# EAGLE design vyndej (EAGLE 9.5.2)
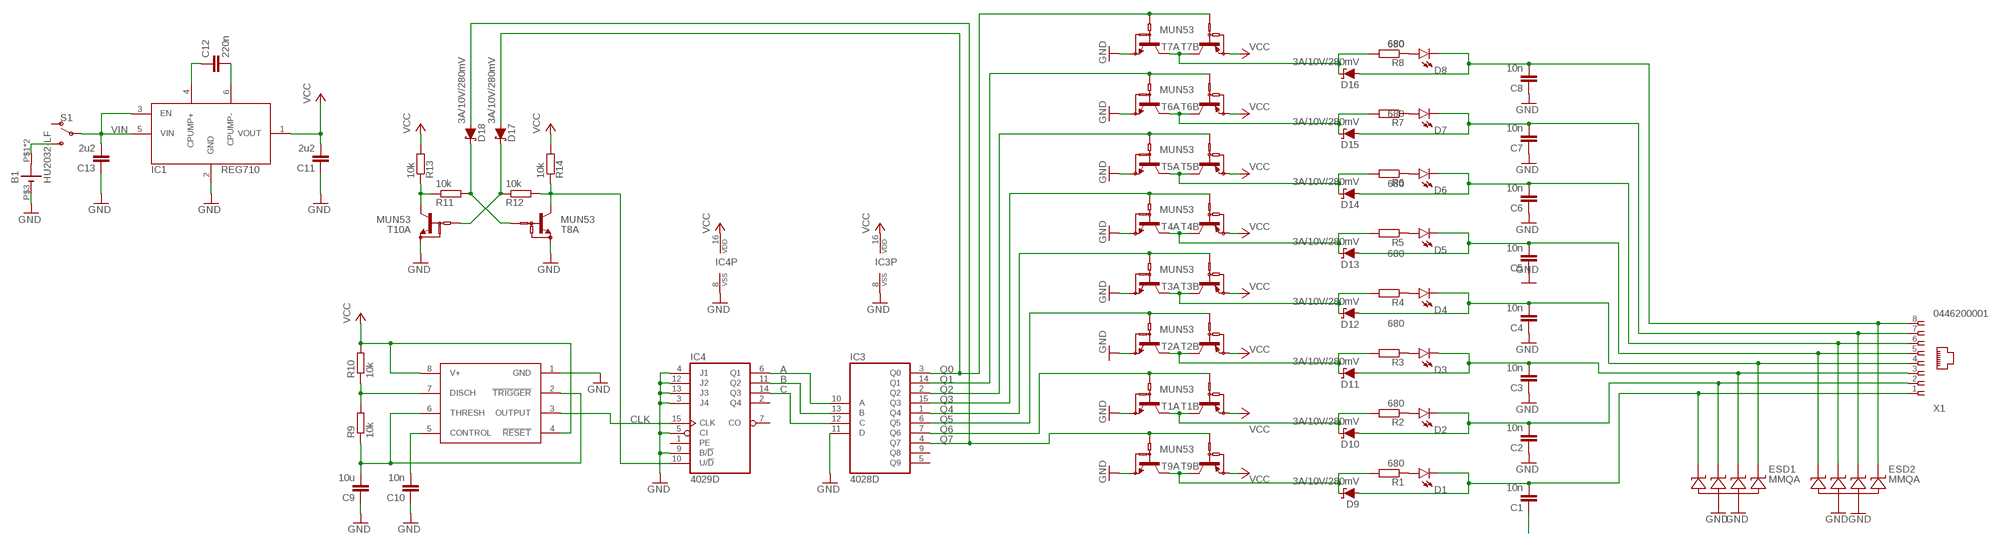
[diagram p0: schematic, sheet 1]

## Parts
B1  HU2032-LF  [HU2032-LF]
C1  10n  C-EUC0603  [C0603]
C2  10n  C-EUC0603  [C0603]
C3  10n  C-EUC0603  [C0603]
C4  10n  C-EUC0603  [C0603]
C5  10n  C-EUC0603  [C0603]
C6  10n  C-EUC0603  [C0603]
C7  10n  C-EUC0603  [C0603]
C8  10n  C-EUC0603  [C0603]
C9  10u  C-EUC1210K  [C1210K]
C10  10n  C-EUC0603  [C0603]
C11  2u2  C-EUC0603  [C0603]
C12  220n  C-EUC0603  [C0603]
C13  2u2  C-EUC0603  [C0603]
D1  RED  LED  [PLCC-2]
D2  RED  LED  [PLCC-2]
D3  RED  LED  [PLCC-2]
D4  RED  LED  [PLCC-2]
D5  RED  LED  [PLCC-2]
D6  RED  LED  [PLCC-2]
D7  RED  LED  [PLCC-2]
D8  RED  LED  [PLCC-2]
D9  3A/10V/280mV  DIODE-SCHOTTKY-BAT60A  [SOD-323]
D10  3A/10V/280mV  DIODE-SCHOTTKY-BAT60A  [SOD-323]
D11  3A/10V/280mV  DIODE-SCHOTTKY-BAT60A  [SOD-323]
D12  3A/10V/280mV  DIODE-SCHOTTKY-BAT60A  [SOD-323]
D13  3A/10V/280mV  DIODE-SCHOTTKY-BAT60A  [SOD-323]
D14  3A/10V/280mV  DIODE-SCHOTTKY-BAT60A  [SOD-323]
D15  3A/10V/280mV  DIODE-SCHOTTKY-BAT60A  [SOD-323]
D16  3A/10V/280mV  DIODE-SCHOTTKY-BAT60A  [SOD-323]
D17  3A/10V/280mV  DIODE-SCHOTTKY-BAT60A  [SOD-323]
D18  3A/10V/280mV  DIODE-SCHOTTKY-BAT60A  [SOD-323]
ESD1  MMQA  [SC-74]
ESD2  MMQA  [SC-74]
IC1  REG710  [SOT23-6]
IC2  LMC555  [SO08]
IC3  4028D  [SO16]
IC4  4029D  [SO16]
R1  680  R-EU_R0603  [R0603]
R2  680  R-EU_R0603  [R0603]
R3  680  R-EU_R0603  [R0603]
R4  680  R-EU_R0603  [R0603]
R5  680  R-EU_R0603  [R0603]
R6  680  R-EU_R0603  [R0603]
R7  680  R-EU_R0603  [R0603]
R8  680  R-EU_R0603  [R0603]
R9  10k  R-EU_R0603  [R0603]
R10  10k  R-EU_R0603  [R0603]
R11  10k  R-EU_R0603  [R0603]
R12  10k  R-EU_R0603  [R0603]
R13  10k  R-EU_R0603  [R0603]
R14  10k  R-EU_R0603  [R0603]
S1  SWITCH-SPDT-SMD-RIGHT-ANGLE  [SWITCH_SPST_SMD_A]
T1  MUN53  [SOT-363]
T2  MUN53  [SOT-363]
T3  MUN53  [SOT-363]
T4  MUN53  [SOT-363]
T5  MUN53  [SOT-363]
T6  MUN53  [SOT-363]
T7  MUN53  [SOT-363]
T8  MUN53  [SOT-363]
T9  MUN53  [SOT-363]
T10  MUN53  [SOT-363]
X1  0446200001  [0446200001]

## Nets
A: IC3.10(A) IC4.6(Q1)
B: IC3.13(B) IC4.11(Q2)
C: IC3.12(C) IC4.14(Q3)
CLK: IC2.3(OUTPUT) IC4.15(CLK)
GND: B1.P$3(-) C2.1 C3.1 C4.1 C5.1 C6.1 C7.1 C8.1 C9.1 C10.1 C11.1 C13.1 ESD1.2(A1) ESD1.5(A2) ESD2.2(A1) ESD2.5(A2) IC1.2(GND) IC2.1(GND) IC3.8(VSS) IC3.11(D) IC4.3(J4) IC4.4(J1) IC4.5(CI) IC4.8(VSS) IC4.9(B/!D) IC4.12(J2) IC4.13(J3) T1.P$1(A:E) T2.P$1(A:E) T3.P$1(A:E) T4.P$1(A:E) T5.P$1(A:E) T6.P$1(A:E) T7.P$1(A:E) T8.P$1(A:E) T9.P$1(A:E) T10.P$1(A:E)
N$1: D8.A R8.1
N$2: D7.A R7.1
N$3: D6.A R6.1
N$4: D5.A R5.1
N$5: D1.A R1.1
N$6: D2.A R2.1
N$7: D3.A R3.1
N$8: D4.A R4.1
N$9: C1.2 D1.C D9.A ESD1.1(C) X1.1
N$10: C2.2 D2.C D10.A ESD1.3(C1) X1.2
N$11: C3.2 D3.C D11.A ESD1.4(C2) X1.3
N$12: C4.2 D4.C D12.A ESD1.6(C3) X1.4
N$13: C5.2 D5.C D13.A ESD2.1(C) X1.5
N$14: C6.2 D6.C D14.A ESD2.3(C1) X1.6
N$15: C7.2 D7.C D15.A ESD2.4(C2) X1.7
N$16: D16.C R8.2 T7.P$3(B:C) T7.P$6(A:C)
N$17: D18.C R11.2 T8.P$2(A:B)
N$18: D15.C R7.2 T6.P$3(B:C) T6.P$6(A:C)
N$19: C8.2 D8.C D16.A ESD2.6(C3) X1.8
N$20: D17.C R12.1 T10.P$2(A:B)
N$21: IC4.10(U/!D) R12.2 R14.1 T8.P$6(A:C)
N$22: R11.1 R13.1 T10.P$6(A:C)
N$23: C1.1
N$24: D12.C R4.2 T3.P$3(B:C) T3.P$6(A:C)
N$25: C12.1 IC1.4(CPUMP+)
N$26: C12.2 IC1.6(CPUMP-)
N$27: C10.2 IC2.5(CONTROL)
N$28: C9.2 IC2.2(!TRIGGER) IC2.6(THRESH) R9.1
N$29: IC2.7(DISCH) R9.2 R10.1
N$30: B1.P$1(+) B1.P$2(+) S1.3(S)
N$44: D14.C R6.2 T5.P$3(B:C) T5.P$6(A:C)
N$45: D13.C R5.2 T4.P$3(B:C) T4.P$6(A:C)
N$46: D9.C R1.2 T9.P$3(B:C) T9.P$6(A:C)
N$47: D10.C R2.2 T1.P$3(B:C) T1.P$6(A:C)
N$48: D11.C R3.2 T2.P$3(B:C) T2.P$6(A:C)
Q0: D17.A IC3.3(Q0) T7.P$2(A:B) T7.P$5(B:B)
Q1: IC3.14(Q1) T6.P$2(A:B) T6.P$5(B:B)
Q2: IC3.2(Q2) T5.P$2(A:B) T5.P$5(B:B)
Q3: IC3.15(Q3) T4.P$2(A:B) T4.P$5(B:B)
Q4: IC3.1(Q4) T3.P$2(A:B) T3.P$5(B:B)
Q5: IC3.6(Q5) T2.P$2(A:B) T2.P$5(B:B)
Q6: IC3.7(Q6) T1.P$2(A:B) T1.P$5(B:B)
Q7: D18.A IC3.4(Q7) T9.P$2(A:B) T9.P$5(B:B)
VCC: C11.2 IC1.1(VOUT) IC2.4(!RESET) IC2.8(V+) IC3.16(VDD) IC4.16(VDD) R10.2 R13.2 R14.2 T1.P$4(B:E) T2.P$4(B:E) T3.P$4(B:E) T4.P$4(B:E) T5.P$4(B:E) T6.P$4(B:E) T7.P$4(B:E) T9.P$4(B:E)
VIN: C13.2 IC1.3(EN) IC1.5(VIN) S1.2(P)
Unconnected: IC3.5(Q9) IC3.9(Q8) IC4.1(PE) IC4.2(Q4) IC4.7(CO) S1.1(O) T8.P$3(B:C) T8.P$4(B:E) T8.P$5(B:B) T10.P$3(B:C) T10.P$4(B:E) T10.P$5(B:B)

## Library data of the parts
B1 = hu2032-lf:HU2032-LF
C1-C13 = rcl:C-EU: CAPACITOR, European symbol; SPICEPREFIX: C
D1-D8 = led:LED
D9-D18 = SparkFun-DiscreteSemi:DIODE-SCHOTTKY: Schottky diode A Schottky diode is a semiconductor diode which has a low forward voltage drop and a very fast switching action.; PROD_ID: DIO-14072
ESD1 ESD2 = on-semiconductor:MMQA
IC1 = reg710:REG710
IC2 = LMC555:LMC555
IC3 = 40xx:4028: BCD to decimal DECODER
IC4 = 40xx:4029: Binary/decimal up/down COUNTER
R1-R14 = rcl:R-EU_: RESISTOR, European symbol; SPICEPREFIX: R
S1 = SparkFun-Switches:SWITCH-SPDT: Single Pole, Double Throw (SPDT) Switch Single-pole, double-throw (SPDT) switch. Variant Overview SMD-AYZ0202 Surface Mount DPDT Switch <https://www.sparkfun.com/products/597> (COM-00597) Used on e.g. LilyPad Arduino USB - ATmega32U4 Board <https://www.sparkfun.com/products/12049> PTH-11.6X4.0MM SPDT Mini Power Switch <https://www.sparkfun.com/products/102> (COM-00102) Used on e.g. SparkFun Simon Says - Through-Hole Soldering Kit <https://www.sparkfun.com/products/10547> (KIT-10547) PTH-11.6X4.0MM-KIT KIT version of SPDT Mini Power Switch - Simplifies soldering by removing tStop of switch pins - only one side can be soldered. PTH-11.6X4.0MM-LOCK LOCK version of SPDT Mini Power Switch - Offset pins hold switch in place for easier soldering. SMD-RIGHT-ANGLE Surface Mount Right Angle Switch <https://www.sparkfun.com/products/10860> (COM-10860) Used on e.g. SparkFun ESP8266 Thing <https://www.sparkfun.com/products/13231>; PROD_ID: SWCH-10651; SF_SKU: COM-10860
T1-T10 = mun:MUN53
X1 = con-molex:0446200001: RJ-45 INVERTED MODULAR JACK ASSEMBLY WITH RJ-11 KEEPOUT FEATURE Source: Data sheet <http://www.farnell.com/datasheets/73207.pdf>; MF: MOLEX; OC_FARNELL: unknown

## Board
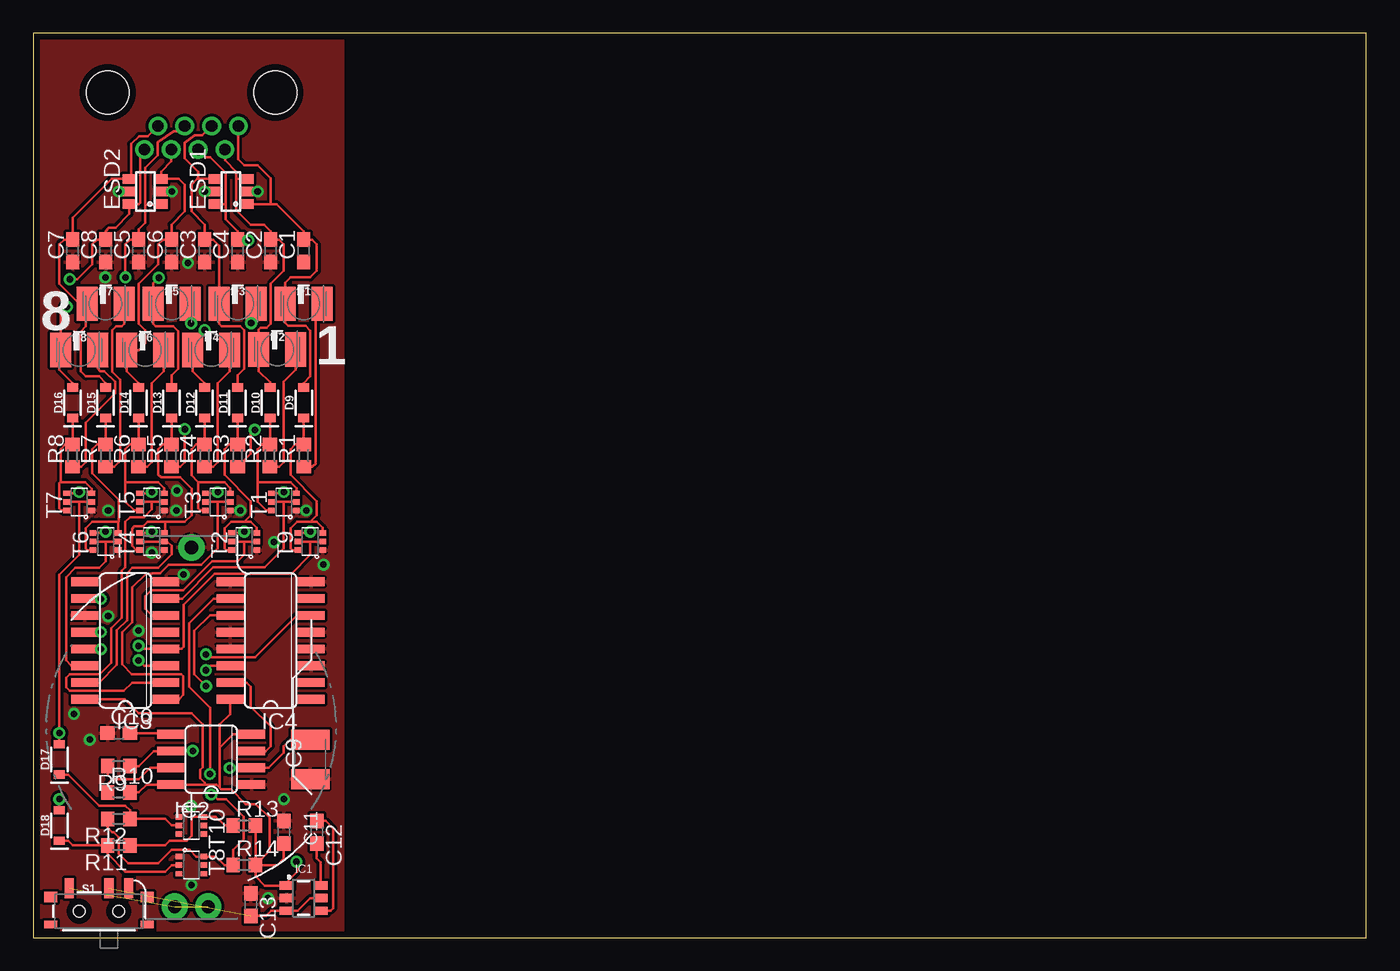
[diagram p1: board, top side]
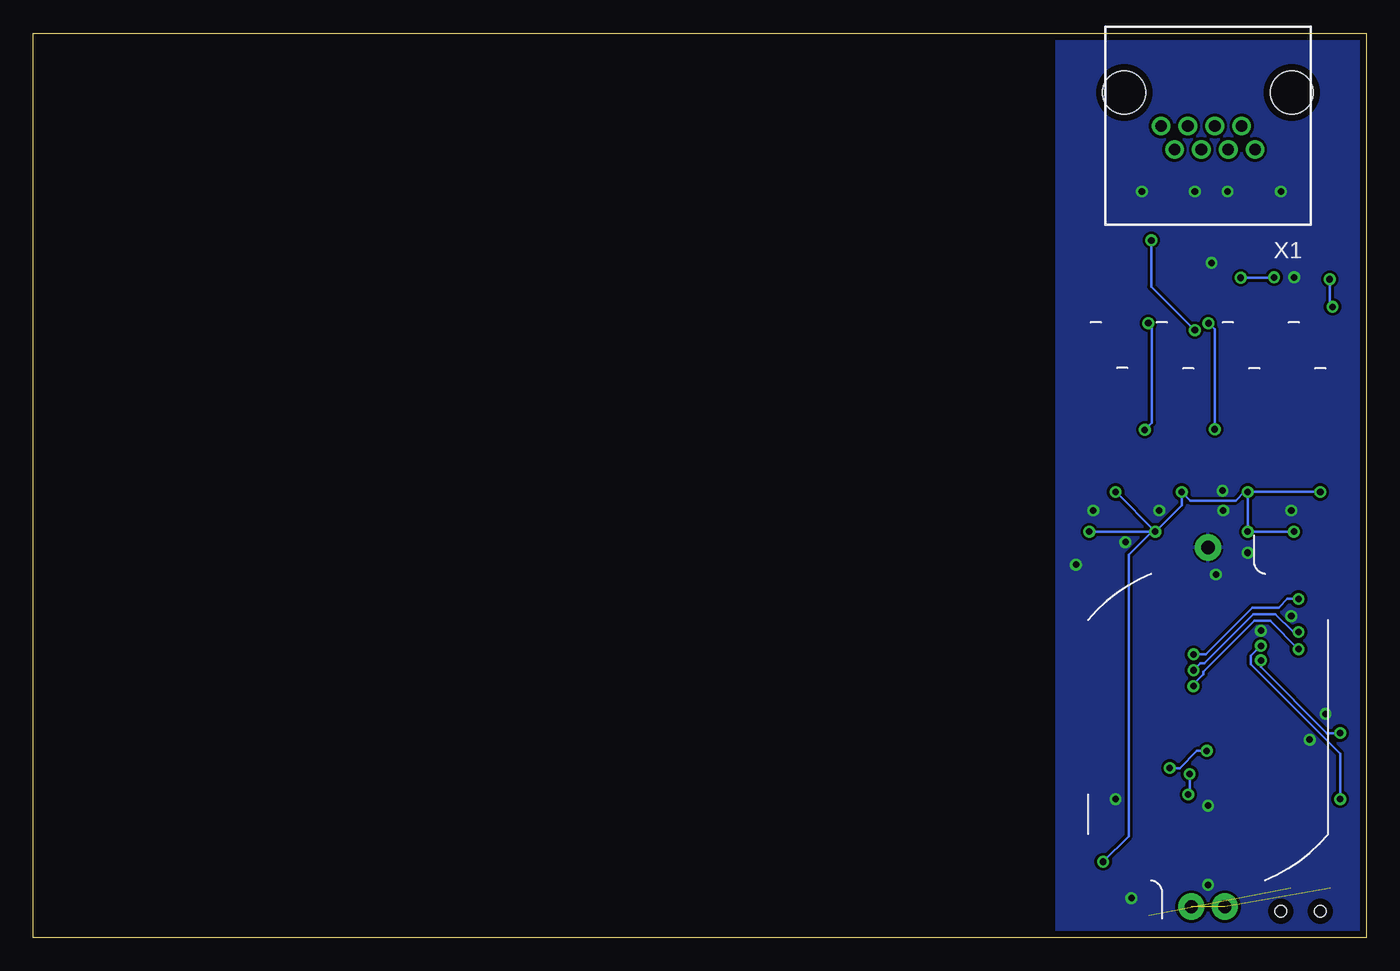
[diagram p2: board, bottom side, seen from below]

Size 101 x 68.5 mm. Coordinates in mm from the lower left corner, seen from the top.
Outline: 0,0 101,0 101,68.5 0,68.5 0,0
Copper layers (1*16): Top 0.035mm / dielectric 1.5mm / Bottom 0.035mm
Design rules "default *": minimum track width 0.2mm, minimum drill 0.5mm, track to track 0.2mm, track to pad 0.2mm, pad to pad 0.2mm, via to via 0.2mm, smd to smd 0mil, copper to edge 0.5mm, drill to drill 0.5mm, minimum pad ring 0.2mm, minimum via ring 0.2mm, stop-mask expansion 0.1mm, vias tented up to drill 0mil, thermal gap 0.15mm

### Footprints (pad centres in the part's own frame; a part is rotated, then mirrored left to right if it is on the bottom)
HU2032-LF = drill 1 pad 2: P$1 -13.6,1.27; P$2 -13.6,-1.27; P$3 13.6,0
C0603 = smd 1.1 x 1: 1 -0.85,0; 2 0.85,0
C1210K = smd 1.5 x 2.9: 1 -1.5,0; 2 1.5,0
PLCC-2 = smd 1.6 x 2.6: A 1.4,0; C -1.4,0
SOD-323 = smd 0.63 x 0.83: A 1.15,0; C -1.15,0
SC-74 = smd 0.7 x 1: 1 -0.95,-1.2; 2 0,-1.2; 3 0.95,-1.2; 4 0.95,1.2; 5 0,1.2; 6 -0.95,1.2
SOT23-6 = smd 0.6 x 1.1: 1 0.95,1.3; 2 0,1.3; 3 -0.95,1.3; 4 -0.95,-1.3; 5 0,-1.3; 6 0.95,-1.3
SO08 = smd 0.66 x 2.032: 1 -1.905,-3.073; 2 -0.635,-3.073; 3 0.635,-3.073; 4 1.905,-3.073; 5 1.905,3.073; 6 0.635,3.073; 7 -0.635,3.073; 8 -1.905,3.073
SO16 = smd 0.66 x 2.032: 1 -4.445,-3.073; 2 -3.175,-3.073; 3 -1.905,-3.073; 4 -0.635,-3.073; 5 0.635,-3.073; 6 1.905,-3.073; 7 3.175,-3.073; 8 4.445,-3.073; 9 4.445,3.073; 10 3.175,3.073; 11 1.905,3.073; 12 0.635,3.073; 13 -0.635,3.073; 14 -1.905,3.073; 15 -3.175,3.073; 16 -4.445,3.073
R0603 = smd 1 x 1.1: 1 -0.85,0; 2 0.85,0
SWITCH_SPST_SMD_A = smd 0.7 x 1.5: 1 -2.25,-1.75; 2 -0.75,-1.75; 3 2.25,-1.75 | smd 1 x 0.6: GND1 -3.65,1; GND3 3.65,1 | smd 1 x 0.8: GND2 -3.65,-1.1; GND4 3.65,-1.1 | hole 0.9: -1.5,0; 1.5,0
SOT-363 = smd 0.4 x 0.5: P$1 -0.65,-0.95; P$2 0,-0.95; P$3 0.65,-0.95; P$4 0.65,0.95; P$5 0,0.95; P$6 -0.65,0.95
0446200001 = drill 0.889 pad 1.422: 1 3.556,2.54; 2 2.54,4.318; 3 1.524,2.54; 4 0.508,4.318; 5 -0.508,2.54; 6 -1.524,4.318; 7 -2.54,2.54; 8 -3.556,4.318 | hole 3.251: 6.35,0; -6.35,0

### Placement (x,y rotation side)
B1  12,15.95 90 top
C1  20.5,52 90 top
C2  18,52 90 top
C3  13,52 90 top
C4  15.5,52 90 top
C5  8,52 90 top
C6  10.5,52 90 top
C7  3,52 90 top
C8  5.5,52 90 top
C9  21,13.5 90 top
C10  6.5,15.5 0 top
C11  19,8 270 top
C12  21.5,8 270 top
C13  16.5,2.5 270 top
D1  20.5,48 0 top
D2  18.5,44.55 0 top
D3  15.5,48 0 top
D4  13.5,44.5 0 top
D5  10.5,48 0 top
D6  8.5,44.5 0 top
D7  5.5,48 0 top
D8  3.5,44.5 0 top
D9  20.5,40.5 90 top
D10  17.95,40.5 90 top
D11  15.5,40.5 90 top
D12  13,40.5 90 top
D13  10.5,40.5 90 top
D14  8,40.5 90 top
D15  5.5,40.5 90 top
D16  3,40.5 90 top
D17  2,13.5 90 top
D18  2,8.5 90 top
ESD1  15,56.5 90 top
ESD2  8.5,56.5 90 top
IC1  20.5,3 90 top
IC2  13.5,13.5 90 top
IC3  7,22.5 90 top
IC4  18,22.5 90 top
R1  20.5,36.5 90 top
R2  17.95,36.5 90 top
R3  15.5,36.5 90 top
R4  13,36.5 90 top
R5  10.5,36.5 90 top
R6  8,36.5 90 top
R7  5.5,36.5 90 top
R8  3,36.5 90 top
R9  6.5,13 180 top
R10  6.5,11 0 top
R11  6.5,7 180 top
R12  6.5,9 180 top
R13  16,8.5 0 top
R14  16,5.5 0 top
S1  5,2 180 top
T1  19,33 90 top
T2  16,30 90 top
T3  14,33 90 top
T4  9,30 90 top
T5  9,33 90 top
T6  5.5,30 90 top
T7  3.5,33 90 top
T8  12,5.5 270 top
T9  21,30 90 top
T10  12,8.5 270 top
X1  12,64 180 bottom

### Tracks (layer width: path | path; a pad name or v marks a point on that pad's centre or on a via)
A  (via drill 0.5)
  Top 0.2: IC3.10 5.12,25.68 v5.15,25.65 | IC4.6 20,24.41 16.83,21.23 13.31,21.23 v13.1,21.45
  Bottom 0.2: v13.1,21.45 12.18,21.45 8.63,25 6.65,25 6,25.65 v5.15,25.65
B  (via drill 0.5)
  Top 0.2: IC3.13 5.13,21.86 v5.15,21.85 | v13.11,19.05 12.22,19.94 12.22,23.23 13.4,24.41 IC4.11
  Bottom 0.2: v5.15,21.85 7.3,24 8.5,24 12.35,20.15 12.35,19.94 13.11,19.18 v13.11,19.05
C  (via drill 0.5)
  Top 0.2: v5.15,23.15 5.13,23.14 IC3.12 | IC4.14 13.45,20.59 v13.1,20.25
  Bottom 0.2: v5.15,23.15 5.56,23.15 6.91,24.5 8.57,24.5 12.28,20.78 12.57,20.78 v13.1,20.25
CLK
  Top 0.2: IC2.3 17.64,14.13 18,14.5 18,16 16.5,17.5 16.5,19 16.18,19.32 IC4.15
GND  (via drill 0.5)
  Top 0.2: v17.02,56.5 ESD1.2 | ESD2.5 v6.48,56.5 | ESD2.2 v10.52,56.5 | ESD1.5 v13,56.5
  other vias: 5.7,32.35 10.85,32.35 15.7,32.35 20.7,32.35 5.7,24.35 9,29.15 22,28.25 18.25,29.95 11.4,27.5 8,23.25 3.1,16.95 4.3,15 10.9,33.85 5.48,50 11.73,51.1 12,10 12,4 17.8,3 19,10.5
  pour Top: 0,68.5 23.5,68.5 23.5,0 0,0
  pour Bottom: 0,68.5 23.5,68.5 23.5,0 0,0
N$1
  Top 0.2: R8.1 3.65,35.65 4,36 4,39 4.96,39.97 4.97,39.97 6.21,41.21 6.21,42.09 5.4,42.9 5.1,42.9 4.9,43.1 D8.A
N$2
  Top 0.2: R7.1 6.15,35.65 6.5,36 6.6,36.1 6.6,37.17 6.62,37.18 6.62,42.26 6,42.87 6,46 6.3,46.3 6.7,46.3 6.9,46.5 D7.A
N$3
  Top 0.2: R6.1 8.65,35.65 9,36 9,42 9.9,42.9 D6.A
N$4  (via drill 0.5)
  Top 0.2: v11.97,46.53 11.97,47.93 D5.A | R5.1 11.15,35.65 11.5,36 v11.5,38.5
  Bottom 0.2: v11.5,38.5 11.5,46.06 v11.97,46.53
N$5
  Top 0.2: D1.A 21.4,47.5 21.4,35.9 21.15,35.65 R1.1
N$6
  Top 0.2: R2.1 18.65,35.65 19,36 19,42.1 19.9,43 D2.A
N$7  (via drill 0.5)
  Top 0.2: D3.A 16.9,46.91 v16.52,46.54 | R3.1 16.5,36.65 16.5,38.45 v16.8,38.45
  Bottom 0.2: v16.52,46.54 16.25,46.26 16.25,39 v16.8,38.45
N$8
  Top 0.2: R4.1 13.65,35.65 14,36 14,42 14.9,42.9 D4.A
N$9
  Top 0.2: X1.1 15.56,58.94 16,58.5 17,58.5 18,57.5 18,55.55 | D9.A 20.5,42 21,42.5 21,45.97 20.65,46.33 19.32,46.33 19.1,46.55 D1.C 19.1,49.6 19.5,50 21,50 21.5,50.5 21.5,52.5 21.15,52.85 C1.2 20.5,53.5 18.45,55.55 18,55.55 | ESD1.1 18,55.55
N$10
  Top 0.2: ESD1.3 15.4,57.45 | 15.4,57.45 15.4,55.08 16.48,54 17.5,54 18,53.5 C2.2 18.65,52.85 19,52.5 19,50.5 18,49.5 18,46.5 17.7,46.2 17.25,46.2 17.1,46.05 D2.C 17.1,42.9 17.95,42.05 D10.A | 15.4,57.45 15.4,58 14.54,58.86 X1.2
N$11
  Top 0.2: X1.3 12.81,60.75 12.25,60.75 11.5,60.2 11.5,60 11.5,59 12.5,58 12.5,57.45 | D11.A 15.5,42.58 16,43.08 16,46 15.7,46.3 14.3,46.3 14.1,46.5 D3.C 14.1,52.4 13.65,52.85 C3.2 13,54 12,55 12,57 12.45,57.45 12.5,57.45 | ESD1.4 12.5,57.45
N$12  (via drill 0.5)
  Top 0.2: D12.A 13,42 12.1,42.9 D4.C 12.1,45.1 v13,46 | v16.3,52.8 16.25,52.85 C4.2 15.5,53.5 14.6,54.4 14.6,55.5 | X1.4 13.1,59.09 13.43,59.09 14.6,57.92 14.6,55.5 | ESD1.6 14.55,55.55 14.6,55.5
  Bottom 0.2: v16.3,52.8 16.3,49.3 v13,46
N$13  (via drill 0.5)
  Top 0.2: X1.5 11.08,61.05 10.67,61.05 9.46,60.23 9.46,59.26 8.5,58.31 8.5,55.48 | D13.A 10.5,42.58 11,43.08 11,45.92 10.62,46.3 9.3,46.3 9.1,46.5 D5.C 9.1,49.54 v9.53,49.97 | ESD2.1 9.63,55.48 8.5,55.48 | 8.5,55.48 8.5,54.15 8,53.65 C5.2 7.35,52.85 7,52.5 v7,50
  Bottom 0.2: v9.53,49.97 7.03,49.97 v7,50
N$14
  Top 0.2: X1.6 10.48,58.78 9.7,58 ESD2.3 11.05,57.45 11.5,57 11.5,55 10.5,54 C6.2 9.85,52.85 9.5,52.5 9.5,51 8,49.5 8,46.5 8.5,46 8.5,45 8,44.5 D6.C 7.1,42.9 8,42 D14.A
N$15
  Top 0.2: X1.7 8.69,60.69 8.03,60.69 7.43,60.1 7.43,57.58 ESD2.4 5.95,57.45 3,54.5 C7.2 2.35,52.85 2,52.5 2,49.5 3.5,48 D7.C 4,47.9 4,46.3 3.6,45.9 3.6,42.9 4,42.5 5,42.5 5.5,42 D15.A
N$16
  Top 0.2: 2.1,34.5 2.1,37 2.45,37.35 R8.2 D16.C | T7.P$3 4.45,34 3.95,34.5 2.1,34.5 | T7.P$6 2.15,32.35 2,32.5 2,34.4 2.1,34.5
N$17
  Top 0.2: T8.P$2 10.5,5.5 10,5 7,5 5.65,6.35 R11.2 3,7 2.65,7.35 D18.C
N$18
  Top 0.2: D15.C R7.2 4.85,37.35 4.5,37 4.5,35.18 6.5,33.18 6.5,31.55 6.45,31.5 | T6.P$3 6.45,31.5 | 6.45,31.5 5,31.5 4.5,31.5 4,31 4,29.5 4.15,29.35 T6.P$6
N$19  (via drill 0.5)
  Top 0.2: D16.A 3,42 2,43 2,44.4 D8.C 2.1,47.3 v2.57,47.77 | X1.8 8.1,59.34 8.1,55.65 8,55.55 ESD2.6 7.3,54.8 6.25,53.75 5.75,53.75 5.5,53.5 C8.2 4.85,52.85 4.5,52.5 4.5,51 3.36,49.86 v2.79,49.86
  Bottom 0.2: v2.79,49.86 2.79,47.99 v2.57,47.77
N$20
  Top 0.2: T10.P$2 10.5,8.5 10,9 R12.1 7.35,9.65 7,10 5,10 2.65,12.35 D17.C
N$21  (via drill 0.5)
  Top 0.2: R12.2 5.65,8.35 6,8 6.12,8 6.5,7.62 6.5,6.38 7.23,5.65 9.5,5.65 10.5,6.65 11.85,6.65 12.35,6.15 T8.P$6 13.85,6.15 14.5,5.5 R14.1 15.15,6.65 15.95,7.45 15.95,9.17 14.62,10.5 14,10.5 13.65,10.85 v13.5,10.85 | IC4.10 13.68,25.68 11.82,23.82 11.82,19 13.4,17.43 v13.4,12.39
  Bottom 0.2: v13.5,10.85 13.4,10.95 v13.4,12.39
N$22
  Top 0.2: R13.1 14.5,8.5 13.85,9.15 T10.P$6 12,9.15 12,7.73 11.62,7.35 10.35,7.35 10,7 R11.1
N$24
  Top 0.2: T3.P$6 12.65,32.35 12.5,32.5 12.5,34.5 | D12.C R4.2 12.35,37.35 12,37 12,35 12.5,34.5 | T3.P$3 14.95,34.05 14.5,34.5 12.5,34.5
N$25
  Top 0.2: IC1.4 22.55,2.05 22.75,2.25 22.75,8.25 22.15,8.85 C12.1
N$26
  Top 0.2: IC1.6 21.8,5.7 21.5,6 C12.2
N$27
  Top 0.2: IC2.5 9.5,15.4 9.4,15.5 C10.2
N$28  (via drill 0.5)
  Top 0.2: C9.2 19.5,15 19,14.5 19,14 17.86,12.87 IC2.2 14.91,12.87 v14.9,12.85 | v12.1,14.15 12.09,14.13 IC2.6 9.13,14.13 8,13 R9.1
  Bottom 0.2: v12.1,14.15 12.85,14.15 14.15,12.85 v14.9,12.85
N$29
  Top 0.2: IC2.7 8.87,12.87 8,12 6,12 | 6,12 5.65,12.35 R9.2 | 6,12 5.65,11.65 R10.1
N$30  (2 unrouted)
N$44
  Top 0.2: T5.P$6 7.65,32.35 7,33 7,34.5 | 7,34.5 7,37 7.35,37.35 R6.2 D14.C | 7,34.5 9.5,34.5 9.95,34.05 T5.P$3
N$45
  Top 0.2: D13.C R5.2 9.85,37.35 9.5,37 9.5,35.07 9.72,34.85 11.15,34.85 12,34 12,32 11.5,31.5 10,31.5 | 10,31.5 8.69,31.5 8.34,31.15 7.68,31.15 7.5,30.97 7.5,29.68 7.83,29.35 T4.P$6 | 10,31.5 10,30.7 T4.P$3
N$46
  Top 0.2: T9.P$6 19.65,29.35 19.5,29.5 19.5,31 20,31.5 21,31.5 | D9.C R1.2 19.85,37.35 19.5,37 19.5,35.07 21.5,33.07 21.5,32 21,31.5 | T9.P$3 21.95,31.05 21.5,31.5 21,31.5
N$47
  Top 0.2: 17,34.5 17,37 17.35,37.35 R2.2 D10.C | 17,34.5 17,33 17.65,32.35 T1.P$6 | 17,34.5 19.5,34.5 19.95,34.05 T1.P$3
N$48
  Top 0.2: T2.P$6 14.65,29.35 14.5,29.5 14.5,31 15,31.5 16,31.5 | D11.C R3.2 14.85,37.35 14.5,37 14.5,35.07 16.5,33.07 16.5,32 16,31.5 | T2.P$3 16.95,31.05 16.5,31.5 16,31.5
Q0  (via drill 0.5)
  Top 0.2: T7.P$5 3.5,33 | 3.5,33 T7.P$2 | v8,21 8.41,20.59 IC3.3 | D17.A v2,15.5 2,27.5 3.5,29 3.5,33
  Bottom 0.2: v8,21 8,20.5 3,15.5 v2,15.5
Q1
  Top 0.2: T6.P$5 5.5,30 | 5.5,30 T6.P$2 | IC3.14 2.91,20.59 2.5,21 2.5,27.29 3.21,28 5,28 5.5,28.5 5.5,30
Q2
  Top 0.2: T5.P$5 9,33 | 9,33 T5.P$2 | IC3.2 7.5,19.32 6.86,18.68 2.8,18.68 2.5,18.98 2.5,19.67 2.8,19.96 5.07,19.96 5.94,20.84 5.94,23.44 6.72,24.22 6.72,27.78 7,28.06 7,31.5 7.35,31.85 8.42,31.85 9,32.43 9,33
Q3
  Top 0.2: IC3.15 5,19.32 6.34,20.66 6.34,23.27 7.12,24.05 7.12,27.62 7.5,28 9.47,28 10.5,29.03 10.5,29.67 10.17,30 T4.P$2 T4.P$5
Q4
  Top 0.2: T3.P$5 14,33 | 14,33 T3.P$2 | IC3.1 11.05,18.05 11.39,18.39 11.39,19.78 11.21,19.95 7.48,19.95 6.75,20.69 6.75,23.12 7.52,23.89 7.52,26.52 8.57,27.57 9,27.57 9.02,27.6 9.64,27.6 10.29,28.25 12.75,28.25 14,29.5 14,33
Q5
  Top 0.2: T2.P$2 16,30 | 16,30 T2.P$5 | 16,30 16,29 15.5,28.5 13.56,28.5 11.38,26.32 9.5,26.32 9.49,26.3 8.93,26.3 8.5,25.87 8.5,24.91 9,24.41 IC3.6
Q6
  Top 0.2: T1.P$5 19,33 | 19,33 T1.P$2 | 19,33 19,29.5 17.53,28.03 13.66,28.03 11.3,25.68 IC3.7
Q7  (via drill 0.5)
  Top 0.2: T9.P$5 21,30 | 21,30 T9.P$2 | 21,30 21,29 19.57,27.57 13.77,27.57 11.43,25.23 11.43,22.02 11.27,21.86 IC3.4 8.23,21.86 v8,22.1 | D18.A v2,10.5
  Bottom 0.2: v8,22.1 8.75,21.35 8.75,20.69 2,13.94 v2,10.5
VCC  (via drill 0.5)
  Top 0.2: R14.2 18.5,5.5 19,6 C11.2 | R13.2 R14.2 | R14.2 16.85,4.65 17.55,3.95 IC1.1 19.2,4.2 20,5 20,5.7 v19.95,5.75 | R14.2 17.93,6.58 17.93,9.07 16.88,10.12 16.12,10.12 15,11.25 14.25,11.25 14.15,11.35 | 13,11.6 13.9,11.6 14.15,11.35 | 13,11.6 IC2.8 8.59,11.6 8,11 R10.2 | IC2.4 15.15,15.4 14.15,14.4 | T7.P$4 3.4,33.65 v3.5,33.75 | T6.P$4 5.4,30.65 v5.5,30.75 | T4.P$4 8.9,30.65 v9,30.75 | T2.P$4 15.9,30.65 v16,30.75 | T3.P$4 13.9,33.65 v14,33.75 | T5.P$4 8.9,33.65 v9,33.75 | T1.P$4 18.9,33.65 v19,33.75 | T9.P$4 20.9,30.65 v21,30.75 | 14.15,11.35 14.15,14.4 | 14.15,14.4 14.15,16.15 14.93,16.93 IC4.16 | 13,11.6 13,11.73 12.65,12.08 12.65,12.71 12.85,12.9 12.85,16.15 12,17 8,17 6.95,18.05 IC3.16
  Bottom 0.2: v19.95,5.75 18,7.7 18,29 16.25,30.75 v16,30.75 | v21,30.75 v16,30.75 | v16,30.75 14,32.75 v14,33.75 13.35,33.1 9.9,33.1 9.25,33.75 v9,33.75 | v9,33.75 v3.5,33.75 | v9,33.75 v9,30.75 v5.5,30.75 | v16,30.75 v19,33.75
VIN  (1 unrouted)
  Top 0.2: C13.2 17.65,1.65 18.05,2.05 IC1.3 20.05,2.05 21,3 IC1.5

### Text on the board
tPlace: 8 | 1